# Altium schematic sheet GPIO2.SchDoc
size A; SheetNumber: 7; SheetTotal: 7
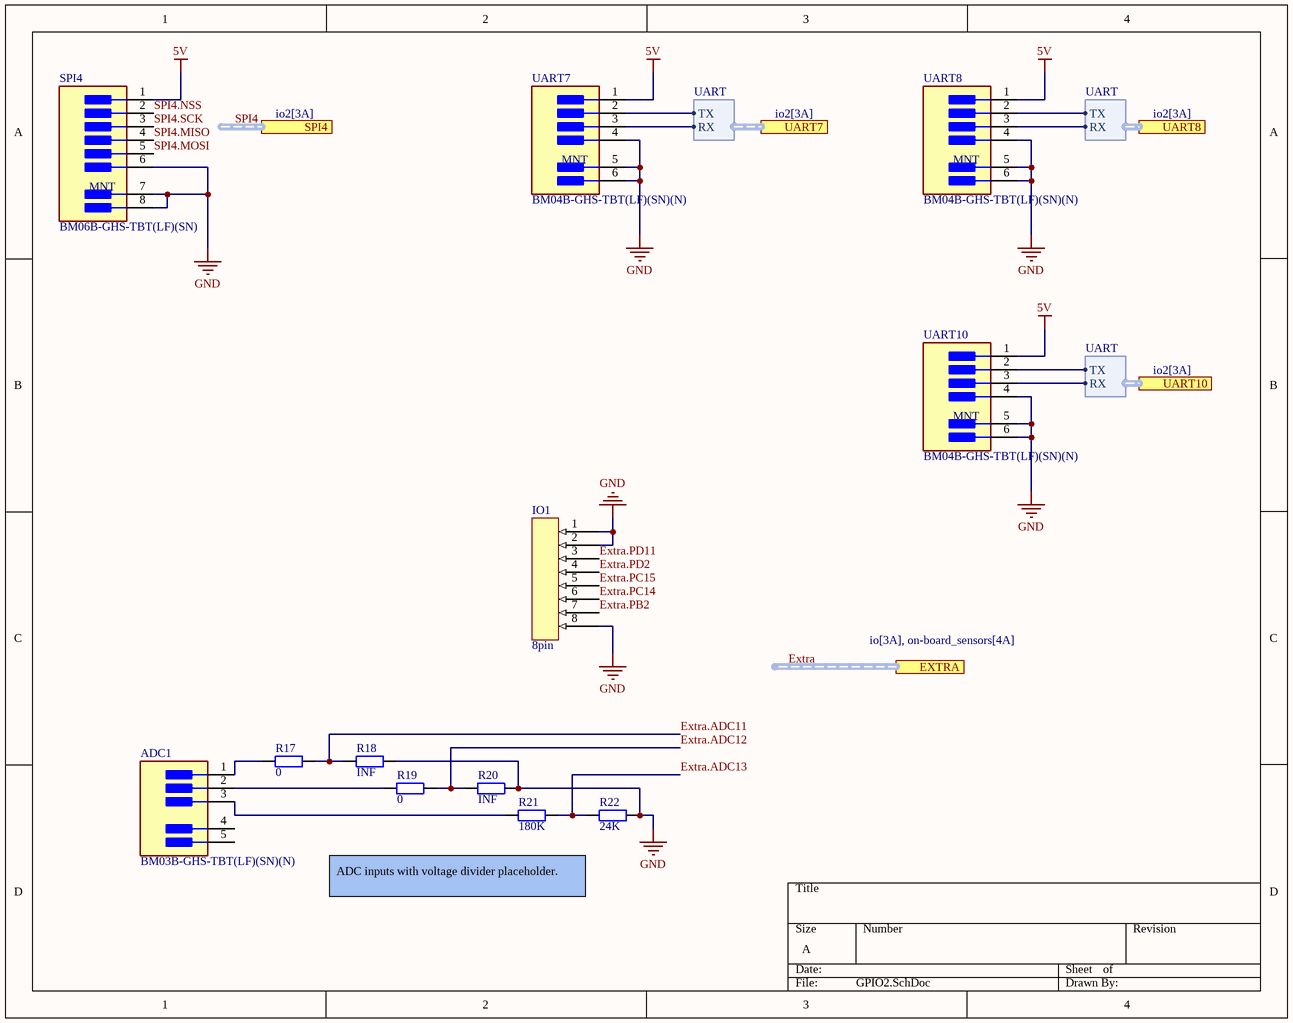
[diagram p0: GPIO2.SchDoc]

## Parts
ADC1  BM03B-GHS-TBT(LF)(SN)(N)  [FP-SM03B-GHS-TB_LF_SN-MFG]
IO1  8pin  [PINS 8x1]
R17  0  [FP_0805_RES]
R18  INF  [FP_0805_RES]
R19  0  [FP_0805_RES]
R20  INF  [FP_0805_RES]
R21  180K  [FP_0805_RES]
R22  24K  [FP_0805_RES]
SPI4  BM06B-GHS-TBT(LF)(SN)  [FP-SM06B-GHS-TB_LF_SN-MFG]
UART7  BM04B-GHS-TBT(LF)(SN)(N)  [FP-SM04B-GHS-TB_LF_SN-MFG]
UART8  BM04B-GHS-TBT(LF)(SN)(N)  [FP-SM04B-GHS-TB_LF_SN-MFG]
UART10  BM04B-GHS-TBT(LF)(SN)(N)  [FP-SM04B-GHS-TB_LF_SN-MFG]

## Ports
EXTRA (harness Extra_pins, see io[3A], on-board_sensors[4A]), SPI4 (harness SPI, see io2[3A]), UART7 (harness UART, see io2[3A]), UART8 (harness UART, see io2[3A]), UART10 (harness UART, see io2[3A])

## Harnesses
UART: RX, TX

## Nets
5V: SPI4.1 UART7.1 UART8.1 UART10.1
GND: IO1.1 IO1.2 IO1.8 R18.2 R20.2 R22.2 SPI4.6 SPI4.7(MNT_1) SPI4.8(MNT_2) UART7.4 UART7.5(MNT_1) UART7.6(MNT_2) UART8.4 UART8.5(MNT_1) UART8.6(MNT_2) UART10.4 UART10.5(MNT_1) UART10.6(MNT_2)
Extra.ADC11: R17.2 R18.1
Extra.ADC12: R19.2 R20.1
Extra.ADC13: R21.2 R22.1
Extra.PB2: IO1.7
Extra.PC14: IO1.6
Extra.PC15: IO1.5
Extra.PD2: IO1.4
Extra.PD11: IO1.3
SPI4.MISO: SPI4.4
SPI4.MOSI: SPI4.5
SPI4.NSS: SPI4.2
SPI4.SCK: SPI4.3
NetADC1_1: ADC1.1 R17.1
NetADC1_2: ADC1.2 R19.1
NetADC1_3: ADC1.3 R21.1
NetUART7_2: UART7.2 ; port UART7.TX
NetUART7_3: UART7.3 ; port UART7.RX
NetUART8_2: UART8.2 ; port UART8.TX
NetUART8_3: UART8.3 ; port UART8.RX
NetUART10_2: UART10.2 ; port UART10.TX
NetUART10_3: UART10.3 ; port UART10.RX

Not connected (* = marked no-connect by the designer): ADC1 4(MNT_1) 5(MNT_2)

## Buses and harness runs
harness Extra = port EXTRA
harness SPI4 = port SPI4

## Notes on the sheet
- ADC inputs with voltage divider placeholder.
- (in symbol CMP-17439-000054-1) MNT
- (in symbol CMP-17439-000166-1) MNT

## Library data of the parts
ADC1 = CMP-17439-000058-1: 3p; Pitch: 0.049inch; Number of Positions: 3; Connector Type: Header; Contact Finish - Mating: TIN; Lead Free: Lead Free; Series: GH; Fastening Type: Ramp; Number of Rows: 1; Insulation Color: Natural; Contact Material: Bronze; Insulation Material: Nylon; Min Operating Temperature: -25°C; Contact Type: Outer Shroud Contact; Max Operating Temperature: 85°C; Termination: Solder; Flammability Rating: UL94 V-0; Color: Natural; Contact Plating: Tin; Contact Shape: Rectangular; Mount: Surface Mount; Packaging: Cut Tape
R17-R22 = RES: Resistor
  R17 R19: Value: 0
  R18 R20: Value: INF
  R21: Value: 180K
  R22: Value: 24K
SPI4 = CMP-17439-000166-1: 6p; Pitch: 1.25mm; Number of Contacts: 6; Current Rating: 1A; Voltage Rating: 50V; Housing Material: Nylon; Lead Free: Lead Free; Packaging: Cut Tape; Number of Rows: 1; Series: GH; Contact Material: Bronze; Orientation: Straight; Termination: Solder; Mount: Surface Mount; Housing Color: Natural; Number of Positions: 6
UART7 UART8 UART10 = CMP-17439-000054-1: 4p; Number of Positions: 4; Pitch: 0.049inch; Connector Type: Outer Shroud Contact; Termination: Solder; Number of Pins: 4; Color: Natural; Number of Rows: 1; Lead Free: Lead Free; Mount: Surface Mount; Contact Plating: Tin; Packaging: Tape and Reel; Fastening Type: Ramp